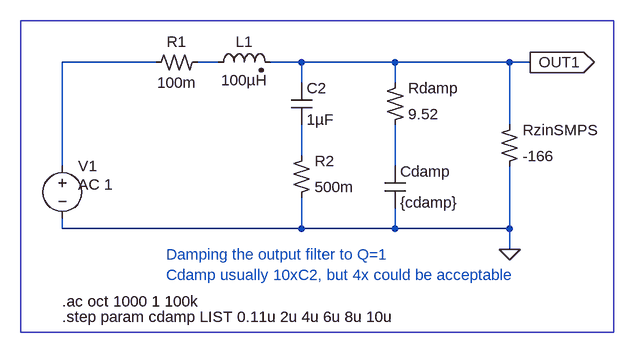
[diagram p0: schematic Switch-Mode Power Supplies - Basso- Figure 1-58.asc]
Switch-Mode Power Supplies - Basso- Figure 1-58.asc, the LTspice schematic file:
Version 4
SHEET 1 880 1052
WIRE -1744 -832 -1888 -832
WIRE -1648 -832 -1680 -832
WIRE -1520 -832 -1568 -832
WIRE -1376 -832 -1520 -832
WIRE -1200 -832 -1376 -832
WIRE -1168 -832 -1200 -832
WIRE -1520 -800 -1520 -832
WIRE -1376 -800 -1376 -832
WIRE -1200 -736 -1200 -832
WIRE -1520 -688 -1520 -736
WIRE -1888 -672 -1888 -832
WIRE -1376 -672 -1376 -736
WIRE -1888 -576 -1888 -592
WIRE -1520 -576 -1520 -624
WIRE -1520 -576 -1888 -576
WIRE -1376 -576 -1376 -608
WIRE -1376 -576 -1520 -576
WIRE -1200 -576 -1200 -672
WIRE -1200 -576 -1376 -576
WIRE -1200 -544 -1200 -576
FLAG -1200 -544 0
FLAG -1168 -832 OUT1
IOPIN -1168 -832 Out
SYMBOL voltage -1888 -688 R0
WINDOW 123 24 44 Left 0
WINDOW 39 0 0 Left 0
WINDOW 3 -97 133 Invisible 0
SYMATTR Value2 AC 1
SYMATTR Value PWL(2m 150 2.000001m 130 5m 130 5.000001m 120 10m 120 10.000001m 102 20m 102 20.000001m 99 30m 99 30.000001m 94.36)
SYMATTR InstName V1
SYMBOL res2 -1680 -848 R90
WINDOW 0 0 32 VBottom 0
WINDOW 3 32 32 VTop 0
SYMATTR InstName R1
SYMATTR Value 100m
SYMBOL ind2 -1664 -816 R270
WINDOW 0 32 56 VTop 0
WINDOW 3 4 56 VBottom 0
SYMATTR InstName L1
SYMATTR Value 100µH
SYMBOL res2 -1536 -624 M180
WINDOW 0 36 56 Left 0
WINDOW 3 36 16 Left 0
SYMATTR InstName R2
SYMATTR Value 500m
SYMBOL cap -1536 -800 R0
SYMATTR InstName C2
SYMATTR Value 1µF
SYMBOL res2 -1392 -736 M180
WINDOW 0 36 56 Left 0
WINDOW 3 36 16 Left 0
SYMATTR InstName Rdamp
SYMATTR Value 9.52
SYMBOL cap -1392 -672 R0
SYMATTR InstName Cdamp
SYMATTR Value {cdamp}
SYMBOL res2 -1216 -672 M180
WINDOW 0 36 56 Left 0
WINDOW 3 36 16 Left 0
SYMATTR InstName RzinSMPS
SYMATTR Value -166
TEXT -1888 -464 Left 0 !.ac oct 1000 1 100k
TEXT -1728 -536 Left 0 ;Damping the output filter to Q=1\nCdamp usually 10xC2, but 4x could be acceptable
TEXT -1888 -440 Left 0 !.step param cdamp LIST 0.11u 2u 4u 6u 8u 10u
RECTANGLE Normal -1952 -896 -1040 -416

The netlist it stands for:
* Switch-Mode Power Supplies - Basso- Figure 1-58.asc
V1 N001 0 PWL(2m 150 2.000001m 130 5m 130 5.000001m 120 10m 120 10.000001m 102 20m 102 20.000001m 99 30m 99 30.000001m 94.36) AC 1
R1 N002 N001 100m
L1 N002 OUT1 100µH
R2 0 N003 500m
C2 OUT1 N003 1µF
Rdamp N004 OUT1 9.52
Cdamp N004 0 {cdamp}
RzinSMPS 0 OUT1 -166
.ac oct 1000 1 100k
* Damping the output filter to Q=1
* Cdamp usually 10xC2, but 4x could be acceptable
.step param cdamp LIST 0.11u 2u 4u 6u 8u 10u
.backanno
.end